# Altium schematic sheet Chip_Tester.SchDoc
size A3; SheetNumber: 1; SheetTotal: 2
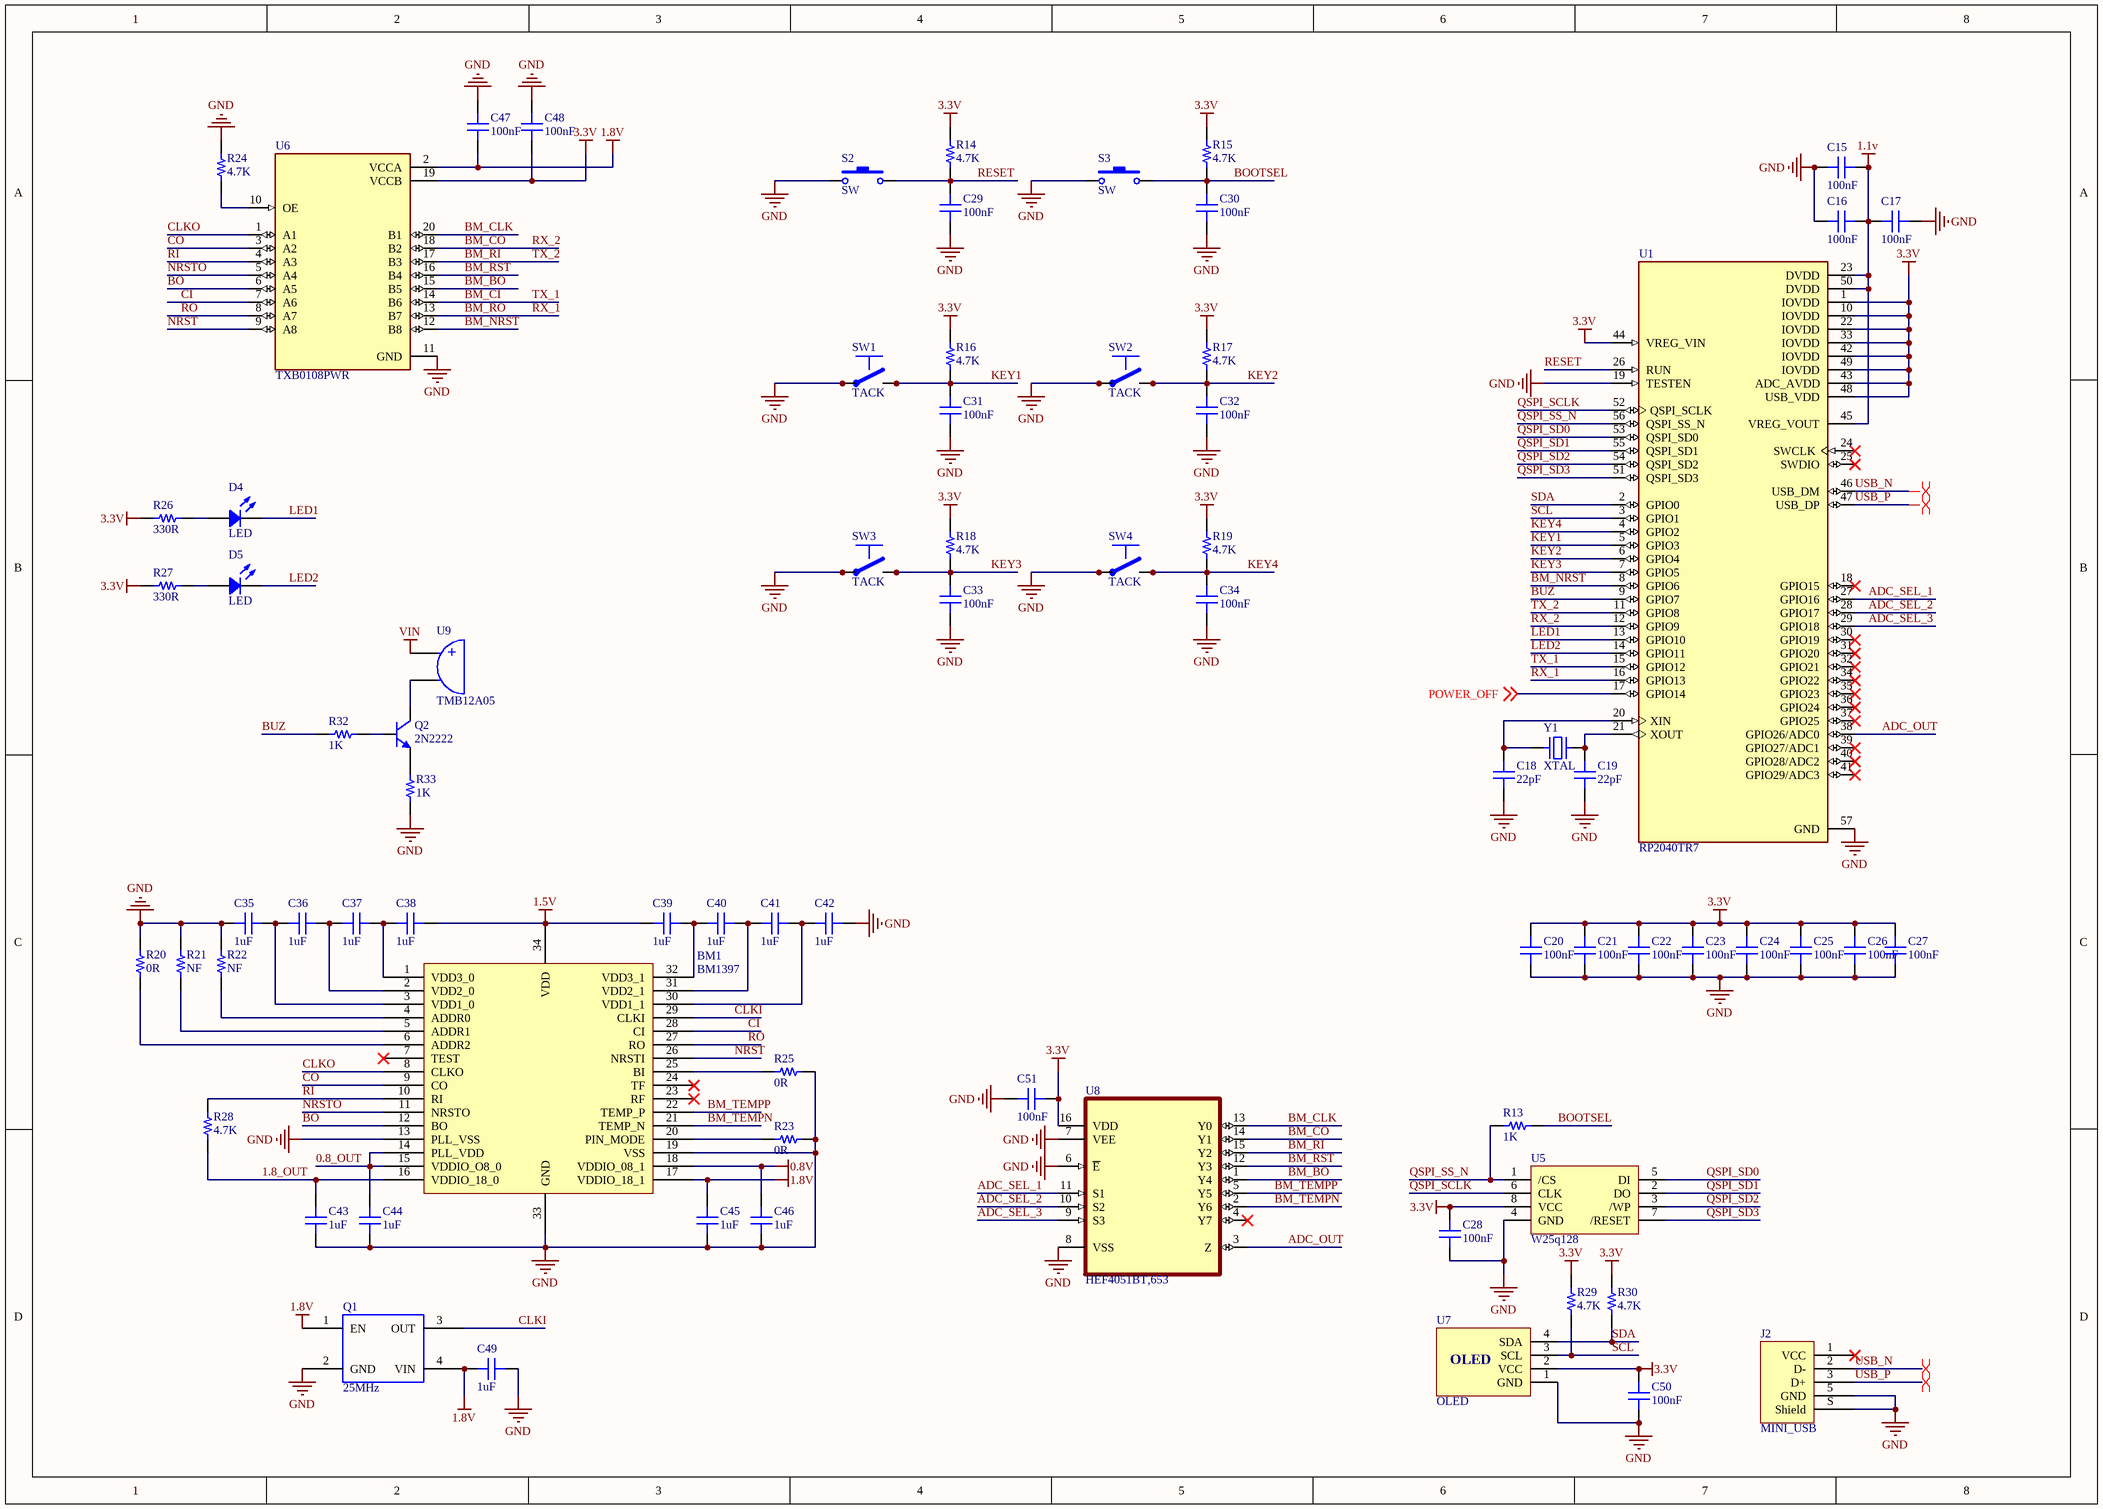
[diagram p0: Chip_Tester.SchDoc]

## Parts
BM1  BM1397  [AllSocket]
C15  100nF  [CAP_SMD_0805]
C16  100nF  [CAP_SMD_0805]
C17  100nF  [CAP_SMD_0805]
C18  22pF  [CAP_SMD_0805]
C19  22pF  [CAP_SMD_0805]
C20  100nF  [CAP_SMD_0805]
C21  100nF  [CAP_SMD_0805]
C22  100nF  [CAP_SMD_0805]
C23  100nF  [CAP_SMD_0805]
C24  100nF  [CAP_SMD_0805]
C25  100nF  [CAP_SMD_0805]
C26  100nF  [CAP_SMD_0805]
C27  100nF  [CAP_SMD_0805]
C28  100nF  [CAP_SMD_0805]
C29  100nF  [CAP_SMD_0805]
C30  100nF  [CAP_SMD_0805]
C31  100nF  [CAP_SMD_0805]
C32  100nF  [CAP_SMD_0805]
C33  100nF  [CAP_SMD_0805]
C34  100nF  [CAP_SMD_0805]
C35  1uF  [CAP_SMD_0805]
C36  1uF  [CAP_SMD_0805]
C37  1uF  [CAP_SMD_0805]
C38  1uF  [CAP_SMD_0805]
C39  1uF  [CAP_SMD_0805]
C40  1uF  [CAP_SMD_0805]
C41  1uF  [CAP_SMD_0805]
C42  1uF  [CAP_SMD_0805]
C43  1uF  [CAP_SMD_0805]
C44  1uF  [CAP_SMD_0805]
C45  1uF  [CAP_SMD_0805]
C46  1uF  [CAP_SMD_0805]
C47  100nF  [CAP_SMD_0805]
C48  100nF  [CAP_SMD_0805]
C49  1uF  [CAP_SMD_0805]
C50  100nF  [CAP_SMD_0805]
C51  100nF  [CAP_SMD_0805]
D4  LED  [LED_0805_RED]
D5  LED  [LED_0805_RED]
J2  MINI_USB  [Mini_usb]
Q1  25MHz  [XTALL]
Q2  2N2222  [SOT-23_H]
R13  1K  [RES-SMD-0805]
R14  4.7K  [RES-SMD-0805]
R15  4.7K  [RES-SMD-0805]
R16  4.7K  [RES-SMD-0805]
R17  4.7K  [RES-SMD-0805]
R18  4.7K  [RES-SMD-0805]
R19  4.7K  [RES-SMD-0805]
R20  0R  [RES-SMD-0805]
R21  NF  [RES-SMD-0805]
R22  NF  [RES-SMD-0805]
R23  0R  [RES-SMD-0805]
R24  4.7K  [RES-SMD-0805]
R25  0R  [RES-SMD-0805]
R26  330R  [RES-SMD-0805]
R27  330R  [RES-SMD-0805]
R28  4.7K  [RES-SMD-0805]
R29  4.7K  [RES-SMD-0805]
R30  4.7K  [RES-SMD-0805]
R32  1K  [RES-SMD-0805]
R33  1K  [RES-SMD-0805]
S2  SW  [SW_PB_SMD_2PIN_SPST_6X3X5]
S3  SW  [SW_PB_SMD_2PIN_SPST_6X3X5]
SW1  TACK  [TACK]
SW2  TACK  [TACK]
SW3  TACK  [TACK]
SW4  TACK  [TACK]
U1  RP2040TR7  [RP2040-57N]
U5  W25q128  [WINBOND SOIC-8]
U6  TXB0108PWR  [SOP65P640X120-20N]
U7  OLED  [OLED]
U8  HEF4051BT,653  [SOIC127P600X175-16N]
U9  TMB12A05  [BUZZER_TMB12A05]
Y1  XTAL  [XTAL_SMD]

## Nets
0.8V: BM1.18(VDDIO_08_1) C46.2
1.1v: C15.2 C16.2 C17.1 U1.23(DVDD) U1.45(VREG_VOUT) U1.50(DVDD)
1.5V: BM1.34(VDD) C38.2 C39.1
1.8V: BM1.17(VDDIO_18_1) C45.2 C47.1 C49.2 Q1.1(EN) Q1.4(VIN) U6.2(VCCA)
3.3V: C20.1 C21.1 C22.1 C23.1 C24.1 C25.1 C26.1 C27.1 C28.1 C48.1 C50.2 C51.2 R14.2 R15.2 R16.2 R17.2 R18.2 R19.2 R26.2 R27.2 R29.2 R30.2 U1.1(IOVDD) U1.10(IOVDD) U1.22(IOVDD) U1.33(IOVDD) U1.42(IOVDD) U1.43(ADC_AVDD) U1.44(VREG_VIN) U1.48(USB_VDD) U1.49(IOVDD) U5.8(VCC) U6.19(VCCB) U7.2(VCC) U8.16(VDD)
GND: BM1.13(PLL_VSS) BM1.19(VSS) BM1.33(GND) C15.1 C16.1 C17.2 C18.2 C19.2 C20.2 C21.2 C22.2 C23.2 C24.2 C25.2 C26.2 C27.2 C28.2 C29.1 C30.1 C31.1 C32.1 C33.1 C34.1 C35.1 C42.2 C43.1 C44.1 C45.1 C46.1 C47.2 C48.2 C49.1 C50.1 C51.1 J2.5(GND) J2.S(Shield) Q1.2(GND) R20.2 R21.2 R22.2 R23.1 R24.2 R25.1 R33.2 S2.1 S3.1 SW1.1 SW1.2 SW2.1 SW2.2 SW3.1 SW3.2 SW4.1 SW4.2 U1.19(TESTEN) U1.57(GND) U5.4(GND) U6.11(GND) U7.1(GND) U8.6(~{E}) U8.7(VEE) U8.8(VSS)
VIN: U9.1
0.8_OUT: BM1.14(PLL_VDD) BM1.15(VDDIO_O8_0) C44.2
1.8_OUT: BM1.16(VDDIO_18_0) C43.2 R28.1
ADC_OUT: U1.38(GPIO26/ADC0) U8.3(Z)
ADC_SEL_1: U1.27(GPIO16) U8.11(S1)
ADC_SEL_2: U1.28(GPIO17) U8.10(S2)
ADC_SEL_3: U1.29(GPIO18) U8.9(S3)
BM_BO: U6.15(B5) U8.1(Y4)
BM_CI: U1.15(GPIO12) U6.14(B6)  [also labelled TX_1]
BM_CLK: U6.20(B1) U8.13(Y0)
BM_CO: U1.12(GPIO9) U6.18(B2) U8.14(Y1)  [also labelled RX_2]
BM_NRST: U1.8(GPIO6) U6.12(B8)
BM_RI: U1.11(GPIO8) U6.17(B3) U8.15(Y2)  [also labelled TX_2]
BM_RO: U1.16(GPIO13) U6.13(B7)  [also labelled RX_1]
BM_RST: U6.16(B4) U8.12(Y3)
BM_TEMPN: BM1.21(TEMP_N) U8.2(Y6)
BM_TEMPP: BM1.22(TEMP_P) U8.5(Y5)
BO: BM1.12(BO) U6.6(A5)
BOOTSEL: C30.2 R13.2 R15.1 S3.2
BUZ: R32.1 U1.9(GPIO7)
CI: BM1.28(CI) U6.7(A6)
CLKI: BM1.29(CLKI) Q1.3(OUT)
CLKO: BM1.8(CLKO) U6.1(A1)
CO: BM1.9(CO) U6.3(A2)
KEY1: C31.2 R16.1 SW1.3 SW1.4 U1.5(GPIO3)
KEY2: C32.2 R17.1 SW2.3 SW2.4 U1.6(GPIO4)
KEY3: C33.2 R18.1 SW3.3 SW3.4 U1.7(GPIO5)
KEY4: C34.2 R19.1 SW4.3 SW4.4 U1.4(GPIO2)
LED1: D4.2 U1.13(GPIO10)
LED2: D5.2 U1.14(GPIO11)
NRST: BM1.26(NRSTI) U6.9(A8)
NRSTO: BM1.11(NRSTO) U6.5(A4)
POWER_OFF: U1.17(GPIO14) ; off-sheet POWER_OFF
QSPI_SCLK: U1.52(QSPI_SCLK) U5.6(CLK)
QSPI_SD0: U1.53(QSPI_SD0) U5.5(DI)
QSPI_SD1: U1.55(QSPI_SD1) U5.2(DO)
QSPI_SD2: U1.54(QSPI_SD2) U5.3(/WP)
QSPI_SD3: U1.51(QSPI_SD3) U5.7(/RESET)
QSPI_SS_N: R13.1 U1.56(QSPI_SS_N) U5.1(/CS)
RESET: C29.2 R14.1 S2.2 U1.26(RUN)
RI: BM1.10(RI) R28.2 U6.4(A3)
RO: BM1.27(RO) U6.8(A7)
SCL: R29.1 U1.3(GPIO1) U7.3(SCL)
SDA: R30.1 U1.2(GPIO0) U7.4(SDA)
USB_N: J2.2(D-) U1.46(USB_DM)
USB_P: J2.3(D+) U1.47(USB_DP)
NetBM1_1: BM1.1(VDD3_0) C37.2 C38.1
NetBM1_2: BM1.2(VDD2_0) C36.2 C37.1
NetBM1_3: BM1.3(VDD1_0) C35.2 C36.1
NetBM1_4: BM1.4(ADDR0) R22.1
NetBM1_5: BM1.5(ADDR1) R21.1
NetBM1_6: BM1.6(ADDR2) R20.1
NetBM1_20: BM1.20(PIN_MODE) R23.2
NetBM1_25: BM1.25(BI) R25.2
NetBM1_30: BM1.30(VDD1_1) C41.2 C42.1
NetBM1_31: BM1.31(VDD2_1) C40.2 C41.1
NetBM1_32: BM1.32(VDD3_1) C39.2 C40.1
NetC18_1: C18.1 U1.20(XIN) Y1.1
NetC19_1: C19.1 U1.21(XOUT) Y1.2
NetD4_1: D4.1 R26.1
NetD5_1: D5.1 R27.1
NetQ2_1: Q2.1(B) R32.2
NetQ2_2: Q2.2(E) R33.1
NetQ2_3: Q2.3(C) U9.2
NetR24_1: R24.1 U6.10(OE)

Not connected (* = marked no-connect by the designer): BM1 7(TEST)* 23(RF)* 24(TF)*; J2 1(VCC)*; U1 18(GPIO15)* 24(SWCLK)* 25(SWDIO)* 30(GPIO19)* 31(GPIO20)* 32(GPIO21)* 34(GPIO22)* 35(GPIO23)* 36(GPIO24)* 37(GPIO25)* 39(GPIO27/ADC1)* 40(GPIO28/ADC2)* 41(GPIO29/ADC3)*; U8 4(Y7)*

## Layout directives
differential pair: USB_N, USB_P

## Notes on the sheet
- (in symbol Buzzer_TMB12A05) +

## Library data of the parts
BM1 = BM1397_0
C15-C51 = CAP
Q1 = OSCILLATOR
Q2 = MMBT2222ALT1G: NPN General Purpose Amplifier; Manufacturer: FAIRCHILD; Link to Datasheet: *; Link to Picture: *; Operating Temp: -55 TO 150 °C; Storage Temp: -55 TO 150 °C; ComponentLink1URL: *; ComponentLink1Description: *; Manufacture Part #: MMBT2222ALT1G; Value: 2N2222
R13-R30 R32 R33 = RES
S2 S3 = SW-PB-2Pin-SMD: SMT Tactile ‎Switch
SW1-SW4 = SW
U1 = RP2040TR7: MCU, 32BIT, 133MHZ, QFN-56; Product Range:-; Architecture:ARM Cortex-M0+; No. of Bits:32bit; CPU Speed:133MHz; Program Memory Size:16MB; RAM Memory Size:264KB; No. of Pins:56Pins; MCU Case Style:QFN; No. of I/O s:30I/O s; MF: Raspberry Pi; SnapEDA_Link: https://www.snapeda.com/parts/RP2040TR7/Raspberry+Pi/view-part/?ref=snap; Value: *; MP: RP2040TR7; Availability: In Stock; Check_prices: https://www.snapeda.com/parts/RP2040TR7/Raspberry+Pi/view-part/?ref=eda; Package: None; Price: None
U6 = TXB0108PWR: 8-Bit Bidirectional Voltage-Level Shifter with Auto Direction Sensing and +/-15-kV ESD Protect; MF: Texas Instruments; SnapEDA_Link: https://www.snapeda.com/parts/TXB0108PWR/Texas+Instruments/view-part/?ref=snap; Package: TSSOP-20 Texas Instruments; MP: TXB0108PWR; Check_prices: https://www.snapeda.com/parts/TXB0108PWR/Texas+Instruments/view-part/?ref=eda; Purchase-URL: https://pricing.snapeda.com/search/part/TXB0108PWR/?ref=eda; Digi-Key_Part_Number: 296-21527-2-ND; Value: *
U8 = HEF4051BT,653: 4000B Series 3 - 15 V 8-Ch Analog Multiplexer/Demultiplexer - SOIC-16; MF: Nexperia USA; Value: *; Purchase-URL: https://pricing.snapeda.com/search/part/HEF4051BT,653/?ref=eda; Price: None; MP: HEF4051BT,653; SnapEDA_Link: https://www.snapeda.com/parts/HEF4051BT,653/Nexperia/view-part/462214/?ref=snap; Check_prices: https://www.snapeda.com/parts/HEF4051BT,653/Nexperia/view-part/462214/?ref=eda; Availability: In Stock; Package: SO-16 Nexperia USA Inc.
U9 = Buzzer_TMB12A05: Integrated Buzzer; Link to Datasheet: *; Link to Picture: *; Manufacturer: http://www.ehuaxing.com/; Operating Temp: -30°C ~ 75°C; Storage Temp: -40°C ~ 85°C; ComponentLink1URL: *; ComponentLink1Description: *; Manufacture Part #: TMB12A05; Value: TMB12A05
Y1 = XTAL: Crystal 8MHz ±50ppm (Tol) ±50ppm (Stability) 20pF FUND 40Ohm 2-Pin HC-49 Thru-Hole Loose; Manufacturer: IQD; Manufacturer Part Number: LFXTAL078428BULK; Supplier 1: Digi-Key; RoHS: No; Stock 1: 784; Pricing 1: 1=0.50000, 10=0.42000, 50=0.37800, 100=0.33600, 500=0.31920, 1000=0.26880, 2500=0.25200, 5000=0.24360, 10000=0.23520 (USD); Supplier Part Number 1: 1923-1403-ND